# EAGLE design SchemaFin (EAGLE 9.5.1)
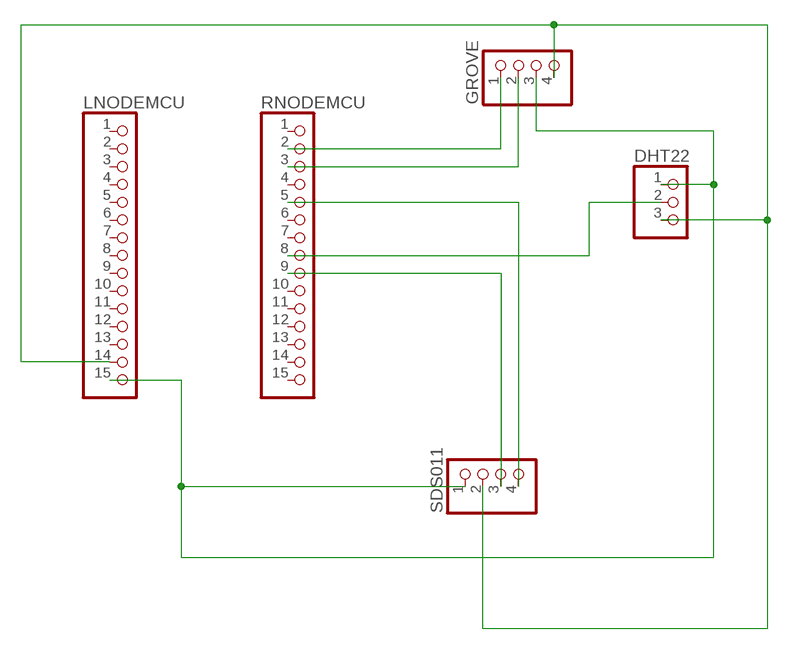
[diagram p0: schematic, sheet 1]

## Parts
DHT22  PINHD-1X3  [1X03]
GROVE  PINHD-1X4M  [1X04M]
LNODEMCU  PINHD-1X15  [1X15]
RNODEMCU  PINHD-1X15  [1X15]
SDS011  PINHD-1X4  [1X04]

## Nets
N$1: GROVE.1 RNODEMCU.2
N$2: GROVE.2 RNODEMCU.3
N$3: RNODEMCU.5 SDS011.4
N$4: DHT22.2 RNODEMCU.8
N$5: RNODEMCU.9 SDS011.3
N$6: DHT22.1 GROVE.3 LNODEMCU.15 SDS011.1
N$7: DHT22.3 GROVE.4 LNODEMCU.14 SDS011.2
Unconnected: LNODEMCU.1 LNODEMCU.2 LNODEMCU.3 LNODEMCU.4 LNODEMCU.5 LNODEMCU.6 LNODEMCU.7 LNODEMCU.8 LNODEMCU.9 LNODEMCU.10 LNODEMCU.11 LNODEMCU.12 LNODEMCU.13 RNODEMCU.1 RNODEMCU.4 RNODEMCU.6 RNODEMCU.7 RNODEMCU.10 RNODEMCU.11 RNODEMCU.12 RNODEMCU.13 RNODEMCU.14 RNODEMCU.15

## Library data of the parts
DHT22 = pinhead:PINHD-1X3: PIN HEADER
GROVE SDS011 = pinhead:PINHD-1X4: PIN HEADER
LNODEMCU RNODEMCU = pinhead:PINHD-1X15: PIN HEADER

## Net classes
0 default: width 0.305 mm, drill 0.508 mm, clearance 0.254 mm

## Board
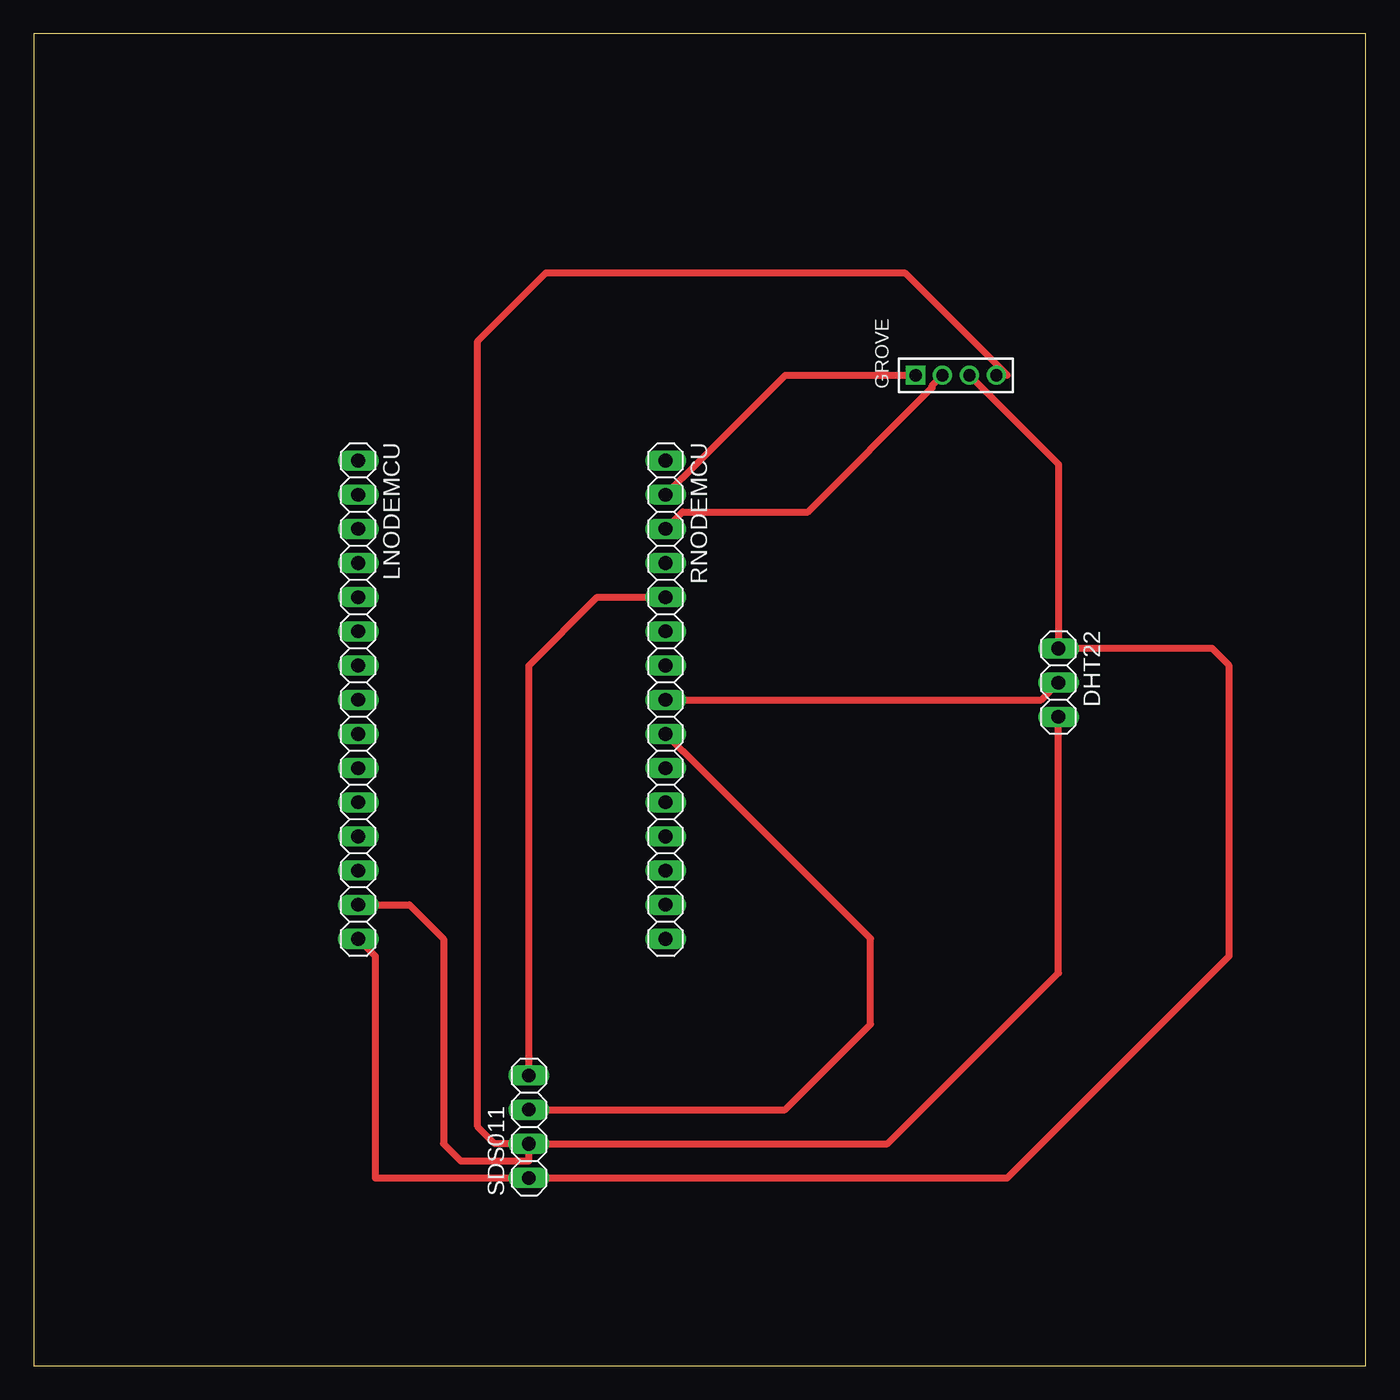
[diagram p1: board, top side]

Size 99.06 x 99.06 mm. Coordinates in mm from the lower left corner, seen from the top.
Outline: 0,0 99.06,0 99.06,99.06 0,99.06 0,0
Copper layers (1*16): Top 0.035mm / dielectric 1.5mm / Bottom 0.035mm
Design rules "default": minimum track width 6mil, minimum drill 0.35mm, track to track 6mil, track to pad 6mil, pad to pad 6mil, via to via 6mil, smd to smd 6mil, copper to edge 40mil, drill to drill 6mil, minimum pad ring 10mil, minimum via ring 8mil, stop-mask expansion 4mil, vias tented up to drill 0mil, thermal gap 10mil

### Footprints (pad centres in the part's own frame; a part is rotated, then mirrored left to right if it is on the bottom)
1X03 = drill 1.016 long: 1 -2.54,0; 2 0,0; 3 2.54,0
1X04M = drill 0.914 square: 1 -3,0 | drill 0.914: 2 -1,0; 3 1,0; 4 3,0
1X15 = drill 1.016 long: 1 -17.78,0; 2 -15.24,0; 3 -12.7,0; 4 -10.16,0; 5 -7.62,0; 6 -5.08,0; 7 -2.54,0; 8 0,0; 9 2.54,0; 10 5.08,0; 11 7.62,0; 12 10.16,0; 13 12.7,0; 14 15.24,0; 15 17.78,0
1X04 = drill 1.016 long: 1 -3.81,0; 2 -1.27,0; 3 1.27,0; 4 3.81,0

### Placement (x,y rotation side)
DHT22  76.2,50.8 270 top
GROVE  68.58,73.66 0 top
LNODEMCU  24.13,49.53 270 top
RNODEMCU  46.99,49.53 270 top
SDS011  36.83,17.78 90 top

### Tracks (layer width: path | path; a pad name or v marks a point on that pad's centre or on a via)
N$1
  Top 0.508: RNODEMCU.2 48.26,66.04 48.28,66.04 55.9,73.66 GROVE.1
N$2
  Top 0.508: RNODEMCU.3 48.26,63.5 57.56,63.5 66.8,72.74 66.8,72.88 GROVE.2
N$3
  Top 0.508: SDS011.4 36.83,52.07 41.91,57.15 RNODEMCU.5
N$4
  Top 0.508: RNODEMCU.8 74.93,49.53 DHT22.2
N$5
  Top 0.508: SDS011.3 55.88,19.05 62.23,25.4 62.23,31.77 48.28,45.72 48.26,45.72 RNODEMCU.9
N$6
  Top 0.508: LNODEMCU.15 25.4,30.48 25.4,13.97 SDS011.1 72.39,13.97 88.9,30.48 88.9,52.07 87.63,53.34 DHT22.1 76.2,67.04 GROVE.3
N$7
  Top 0.508: LNODEMCU.14 27.94,34.29 30.48,31.75 30.48,16.51 31.75,15.24 36.83,15.24 SDS011.2 | SDS011.2 63.5,16.51 76.2,29.21 DHT22.3 | SDS011.2 34.29,16.51 33.02,17.78 33.02,76.2 38.1,81.28 64.77,81.28 72.39,73.66 GROVE.4